# EAGLE design Li-IonSwProtect (EAGLE 8.6.0)
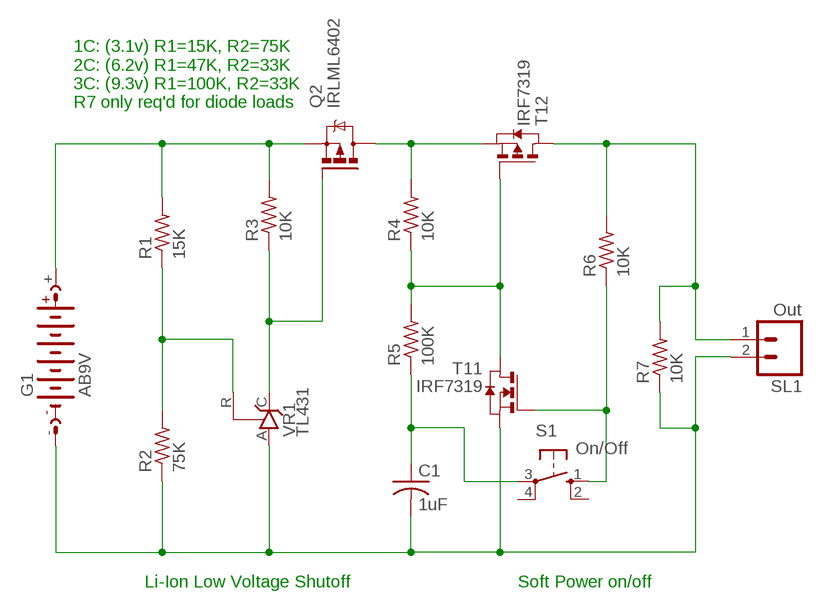
[diagram p0: schematic, sheet 1]

## Parts
C1  1uF  C-USC0805  [C0805]
G1  AB9V  [AB9V]
Q2  IRLML6402  IRLML5203  [MICRO3]
R1  15K  R-US_R0805  [R0805]
R2  75K  R-US_R0805  [R0805]
R3  10K  R-US_R0805  [R0805]
R4  10K  R-US_R0805  [R0805]
R5  100K  R-US_R0805  [R0805]
R6  10K  R-US_R0805  [R0805]
R7  10K  R-US_R0805  [R0805]
S1  On/Off  10-XX  [B3F-10XX]
SL1  Out  M02  [02P]
T1  IRF7319  PN_MOSFET-SO8  [SO8]
VR1  TL431  TL431CLP  [TO92-CLP]

## Nets
N$1: G1.+ Q2.2(S) R1.2 R3.2
N$2: R1.1 R2.2 VR1.R
N$3: C1.2 G1.- R2.1 R7.1 SL1.2 T1.1(1:S) VR1.A
N$4: Q2.3(D) R4.2 T1.3(2:S)
N$5: R4.1 R5.2 T1.4(2:G) T1.7(1:D) T1.8(1:D)
N$6: C1.1 R5.1 S1.3(P)
N$7: Q2.1(G) R3.1 VR1.C
N$9: R6.1 S1.1(S) T1.2(1:G)
N$10: R6.2 R7.2 SL1.1 T1.5(2:D) T1.6(2:D)
Unconnected: S1.2(S1) S1.4(P1)

## Notes on the sheet
- 1C: (3.1v) R1=15K, R2=75K
  2C: (6.2v) R1=47K, R2=33K
  3C: (9.3v) R1=100K, R2=33K
  R7 only req'd for diode loads
- Li-Ion Low Voltage Shutoff | Soft Power on/off

## Library data of the parts
C1 = rcl:C-US: CAPACITOR, American symbol; SPICEPREFIX: C
G1 = battery:AB9V: 9-V BATTERY CLIP
Q2 = transistor-power:IRLML5203: HEXFET P-Channel Power MOSFET
R1-R7 = rcl:R-US_: RESISTOR, American symbol; SPICEPREFIX: R
S1 = switch-omron:10-XX: OMRON SWITCH; MPN: B3F-1000; OC_FARNELL: 176432; OC_NEWARK: 36M3542
SL1 = con-amp-quick:M02: AMP QUICK CONNECTOR; OC_FARNELL: unknown; OC_NEWARK: unknown
T1 = zetex:PN_MOSFET-: DUAL N AND P-CHANNEL ENHANCEMENT MODE MOSFET Source: Data sheet <http://www.farnell.com/datasheets/1693880.pdf>; OC_FARNELL: unknown; OC_NEWARK: unknown
VR1 = v-reg:TL431CLP: VOLTAGE REGULATOR

## Board
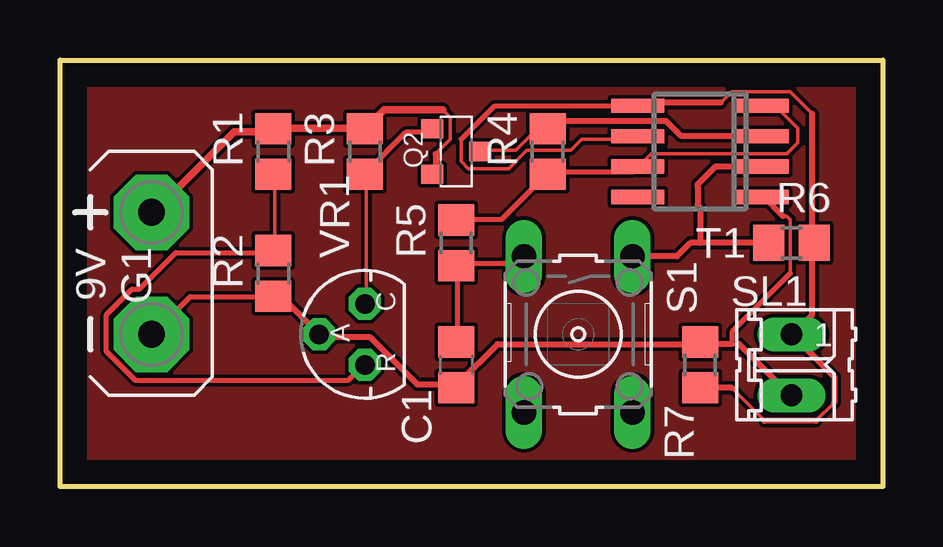
[diagram p1: board, top side]
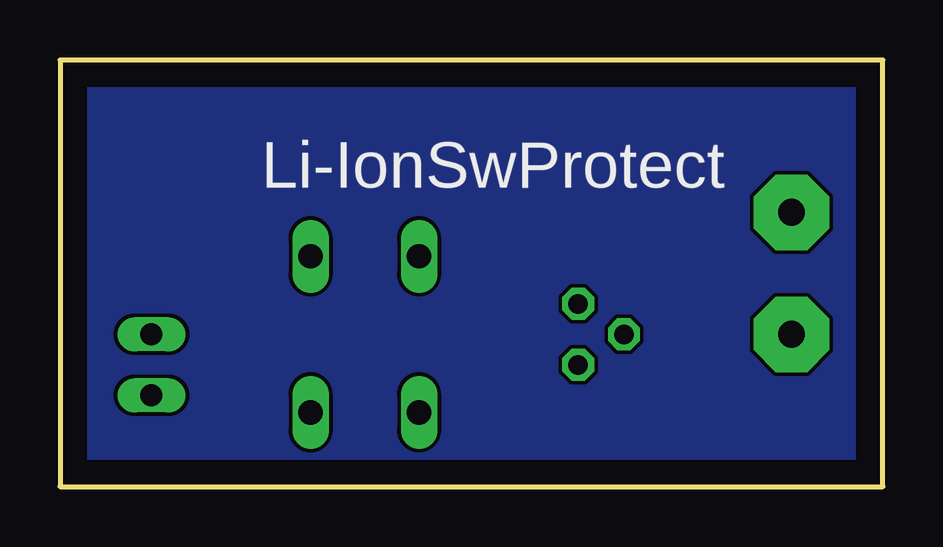
[diagram p2: board, bottom side, seen from below]

Size 34.29 x 17.78 mm. Coordinates in mm from the lower left corner, seen from the top.
Outline: 0,0 0,17.78 34.29,17.78 34.29,0 0,0
Copper layers (1*16): Top 0.035mm / dielectric 1.5mm / Bottom 0.035mm
Design rules "default": minimum track width 6mil, minimum drill 0.35mm, track to track 6mil, track to pad 6mil, pad to pad 6mil, via to via 6mil, smd to smd 6mil, copper to edge 40mil, drill to drill 6mil, minimum pad ring 10mil, minimum via ring 8mil, stop-mask expansion 4mil, vias tented up to drill 0mil, thermal gap 10mil

### Footprints (pad centres in the part's own frame; a part is rotated, then mirrored left to right if it is on the bottom)
C0805 = smd 1.3 x 1.5: 1 -0.95,0; 2 0.95,0
AB9V = drill 1.118 pad 3.15 octagon: + 0,2.54; - 0,-2.54
MICRO3 = smd 0.8 x 0.9: 1 -0.95,-1; 2 0.95,-1; 3 0,1
R0805 = smd 1.3 x 1.5: 1 -0.95,0; 2 0.95,0
B3F-10XX = drill 1.016 long: 1 -3.251,2.261; 2 3.251,2.261; 3 -3.251,-2.261; 4 3.251,-2.261
02P = drill 0.914 long: 1 -1.27,0; 2 1.27,0
SO8 = smd 0.6 x 2.2: 1 -1.905,-2.6; 2 -0.635,-2.6; 3 0.635,-2.6; 4 1.905,-2.6; 5 1.905,2.6; 6 0.635,2.6; 7 -0.635,2.6; 8 -1.905,2.6
TO92-CLP = drill 0.813 octagon: A 0,1.905; C 1.27,0; R -1.27,0

### Placement (x,y rotation side)
C1  16.51,5.08 270 top
G1  3.81,8.89 0 top
Q2  16.51,13.97 270 top
R1  8.89,13.97 90 top
R2  8.89,8.89 90 top
R3  12.7,13.97 90 top
R4  20.32,13.97 90 top
R5  16.51,10.16 90 top
R6  30.48,10.16 0 top
R7  26.67,5.08 270 top
S1  21.59,6.35 270 top
SL1  30.48,5.08 270 top
T1  26.67,13.97 90 top
VR1  12.7,6.35 90 top

### Tracks (layer width: path | path; a pad name or v marks a point on that pad's centre or on a via)
N$1
  Top 0.152: 15.65,13.87 16.26,14.48 16.26,15.39 15.95,15.7 | 15.65,13.11 Q2.2 | 12.75,14.94 R3.2 12.6,14.94 | 8.94,14.94 R1.2 8.79,14.78 | 3.91,11.43 G1.+
  Top 0.254: 15.65,13.87 15.65,13.11
  Top 0.305: 15.95,15.7 13.51,15.7 12.75,14.94 | 12.6,14.94 8.94,14.94 | 8.79,14.78 7.26,14.78 3.91,11.43
N$2
  Top 0.152: R1.1 8.94,12.95 8.94,9.91 R2.2 8.79,9.75 | 12.6,5.03 VR1.R
  Top 0.203: 8.79,9.75 4.83,9.75 3.3,8.23 3,8.23 1.93,7.16 1.93,5.64 3.15,4.42 11.99,4.42 12.6,5.03
N$3
  Top 0.152: 28.3,5.94 27.99,5.94 | 26.77,5.94 R7.1 26.62,5.94 | 30.43,3.81 SL1.2 | 30.12,11.28 30.28,11.28 30.43,11.12 30.43,8.89 | 29.36,12.04 T1.1 | 9.25,7.92 8.94,7.92 R2.1 8.79,7.92 | 10.77,6.4 VR1.A 10.92,6.25 | 16.41,4.27 C1.2 16.56,4.27 | 3.91,6.4 G1.-
  Top 0.203: 8.79,7.92 5.44,7.92 3.91,6.4 | 30.43,8.89 27.99,6.45 27.99,5.94
  Top 0.254: 27.99,5.94 26.77,5.94 | 30.43,3.81 28.3,5.94 | 30.12,11.28 29.36,12.04 | 10.77,6.4 9.25,7.92 | 16.41,4.27 14.88,4.27 12.9,6.25 10.92,6.25 | 26.62,5.94 18.24,5.94 16.56,4.27
N$4
  Top 0.152: Q2.3 17.63,14.02 19,14.02 19.76,14.78 20.22,14.78 R4.2 20.37,14.94 20.68,15.24 | 29.21,14.63 T1.3
  Top 0.254: 29.21,14.63 25.86,14.63 25.25,15.24 20.68,15.24
N$5
  Top 0.152: 16.56,11.12 R5.2 | 20.22,12.95 R4.1 20.37,13.11 | T1.4 29.36,15.85 29.82,15.85 30.73,14.94 30.73,14.33 30.28,13.87 24.64,13.87 24.18,13.41 T1.7 24.03,13.26 23.88,13.11
  Top 0.203: 16.56,11.12 18.39,11.12 20.22,12.95 | 23.88,13.11 20.37,13.11
N$6
  Top 0.152: 16.56,6.1 C1.1 | 16.56,9.14 R5.1 16.56,9.3 | 19.3,9.6 S1.3
  Top 0.203: 16.56,9.14 16.56,6.1 | 16.56,9.3 19,9.3 19.3,9.6
N$7
  Top 0.152: 15.49,14.78 Q2.1 | 12.75,13.11 R3.1 12.75,12.95 12.75,7.62 VR1.C
  Top 0.203: 15.49,14.78 14.43,14.78 12.75,13.11
N$8
  pour Top: 0,17.78 34.29,17.78 34.29,0 0,0
N$9
  Top 0.152: 28.6,13.26 29.21,13.26 T1.2 | 29.52,10.21 R6.1
  Top 0.203: 26.57,12.6 26.57,12.5
  Top 0.254: 26.57,12.5 26.57,11.73 26.67,11.63 26.67,10.16 | S1.1 25.71,9.6 26.26,10.16 26.67,10.16 | T1.2 27.3,13.34 26.57,12.6 | R6.1 26.67,10.16
N$10
  Top 0.152: 16.71,14.48 16.71,13.56 17.02,13.26 18.69,13.26 19.46,14.02 21.29,14.02 21.74,14.48 24.03,14.48 T1.6 | 24.03,15.85 T1.5 24.18,16 | 29.36,2.74 27.99,4.12 | 32.26,3.5 31.5,2.74 | 26.77,4.12 R7.2 | 31.34,10.06 R6.2 31.34,10.21 | 30.58,6.4 SL1.1 | 27.53,16 27.99,16.46 30.43,16.46 31.34,15.54
  Top 0.203: 16.71,14.48 18.09,15.85 24.03,15.85
  Top 0.254: 27.99,4.12 26.77,4.12 | 31.5,2.74 29.36,2.74 | 32.26,3.5 32.26,4.57 SL1.1 | 31.34,10.06 31.34,7.16 30.58,6.4 | 27.53,16 24.18,16 | 31.34,10.21 31.34,15.54
N$11
  pour Bottom: 0,17.78 34.29,17.78 34.29,0 0,0

### Text on the board
bNames: Li-IonSwProtect
bDocu: Li-IonSwProtect